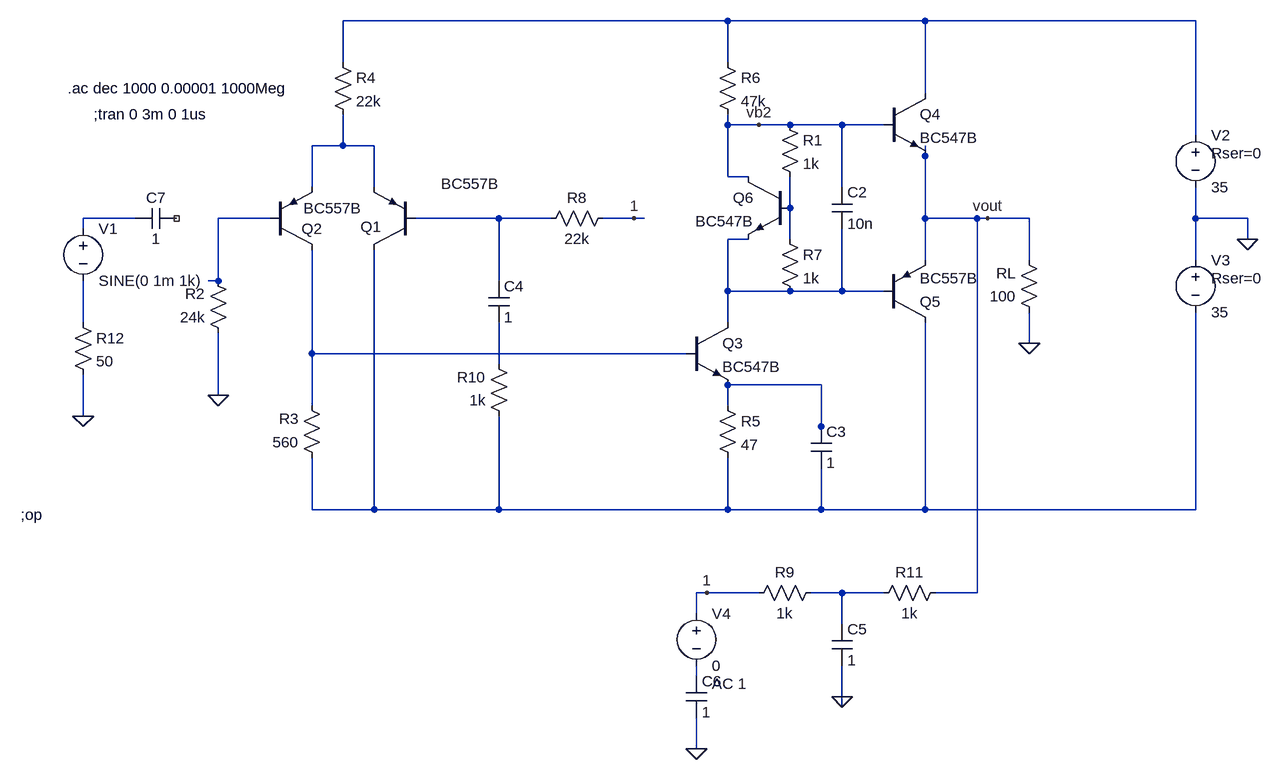
[diagram p0: schematic amplificador clase B.asc]
amplificador clase B.asc, the LTspice schematic file:
Version 4
SHEET 1 1220 680
WIRE -288 -512 -880 -512
WIRE 16 -512 -288 -512
WIRE 432 -512 16 -512
WIRE -880 -448 -880 -512
WIRE -288 -448 -288 -512
WIRE 16 -400 16 -512
WIRE -288 -352 -288 -368
WIRE -240 -352 -288 -352
WIRE -192 -352 -240 -352
WIRE -112 -352 -192 -352
WIRE -48 -352 -112 -352
WIRE 432 -336 432 -512
WIRE -880 -320 -880 -368
WIRE -880 -320 -928 -320
WIRE -832 -320 -880 -320
WIRE 16 -304 16 -320
WIRE -288 -272 -288 -352
WIRE -256 -272 -288 -272
WIRE -928 -256 -928 -320
WIRE -832 -256 -832 -320
WIRE -112 -256 -112 -352
WIRE -192 -224 -192 -272
WIRE -1200 -208 -1280 -208
WIRE -992 -208 -1072 -208
WIRE -640 -208 -768 -208
WIRE -560 -208 -640 -208
WIRE -432 -208 -480 -208
WIRE -416 -208 -432 -208
WIRE 16 -208 16 -304
WIRE 96 -208 16 -208
WIRE 112 -208 96 -208
WIRE 176 -208 112 -208
WIRE 432 -208 432 -256
WIRE 512 -208 432 -208
WIRE -1280 -192 -1280 -208
WIRE -256 -176 -288 -176
WIRE -192 -176 -192 -224
WIRE 512 -176 512 -208
WIRE 16 -144 16 -208
WIRE 176 -144 176 -208
WIRE 432 -144 432 -208
WIRE -1072 -112 -1072 -208
WIRE -1072 -112 -1088 -112
WIRE -640 -112 -640 -208
WIRE -288 -96 -288 -176
WIRE -192 -96 -288 -96
WIRE -112 -96 -112 -192
WIRE -112 -96 -192 -96
WIRE -48 -96 -112 -96
WIRE -1280 -48 -1280 -112
WIRE -288 -48 -288 -96
WIRE 176 -16 176 -64
WIRE -928 0 -928 -160
WIRE -352 0 -928 0
WIRE -640 16 -640 -48
WIRE -144 48 -288 48
WIRE -1072 64 -1072 -32
WIRE -928 80 -928 0
WIRE -288 80 -288 48
WIRE -1280 96 -1280 32
WIRE -144 112 -144 48
WIRE -144 128 -144 112
WIRE -928 240 -928 160
WIRE -832 240 -832 -160
WIRE -832 240 -928 240
WIRE -640 240 -640 96
WIRE -640 240 -832 240
WIRE -288 240 -288 160
WIRE -288 240 -640 240
WIRE -144 240 -144 176
WIRE -144 240 -288 240
WIRE 16 240 16 -48
WIRE 16 240 -144 240
WIRE 432 240 432 -64
WIRE 432 240 16 240
WIRE -320 368 -336 368
WIRE -240 368 -320 368
WIRE -112 368 -160 368
WIRE -48 368 -112 368
WIRE 96 368 96 -208
WIRE 96 368 32 368
WIRE -336 400 -336 368
WIRE -112 416 -112 368
WIRE -336 496 -336 480
WIRE -112 528 -112 480
WIRE -112 544 -112 528
WIRE -336 608 -336 560
FLAG 512 -176 0
FLAG -1072 64 0
FLAG 176 -16 0
FLAG 112 -208 vout
FLAG -240 -352 vb2
FLAG -112 528 0
FLAG -336 608 0
FLAG -432 -208 1
FLAG -1280 96 0
FLAG -320 368 1
SYMBOL res -896 -464 R0
SYMATTR InstName R4
SYMATTR Value 22k
SYMBOL res -1056 -16 R180
WINDOW 0 36 76 Left 2
WINDOW 3 36 40 Left 2
SYMATTR InstName R2
SYMATTR Value 24k
SYMBOL res -912 176 R180
WINDOW 0 36 76 Left 2
WINDOW 3 36 40 Left 2
SYMATTR InstName R3
SYMATTR Value 560
SYMBOL res -304 64 R0
SYMATTR InstName R5
SYMATTR Value 47
SYMBOL res -304 -464 R0
SYMATTR InstName R6
SYMATTR Value 47k
SYMBOL res -464 -224 R90
WINDOW 0 0 56 VBottom 2
WINDOW 3 32 56 VTop 2
SYMATTR InstName R8
SYMATTR Value 22k
SYMBOL res -624 112 R180
WINDOW 0 36 76 Left 2
WINDOW 3 36 40 Left 2
SYMATTR InstName R10
SYMATTR Value 1k
SYMBOL res 192 -48 R180
WINDOW 0 36 76 Left 2
WINDOW 3 36 40 Left 2
SYMATTR InstName RL
SYMATTR Value 100
SYMBOL voltage 432 -352 R0
WINDOW 123 0 0 Left 2
WINDOW 39 24 44 Left 2
SYMATTR SpiceLine Rser=0
SYMATTR InstName V2
SYMATTR Value 35
SYMBOL voltage 432 -160 R0
WINDOW 123 0 0 Left 2
WINDOW 39 24 44 Left 2
SYMATTR SpiceLine Rser=0
SYMATTR InstName V3
SYMATTR Value 35
SYMBOL pnp -768 -160 R180
WINDOW 0 53 35 Left 2
WINDOW 3 -128 101 Left 2
SYMATTR InstName Q1
SYMATTR Value BC557B
SYMBOL pnp -992 -160 M180
WINDOW 0 48 32 Left 2
WINDOW 3 51 64 Left 2
SYMATTR InstName Q2
SYMATTR Value BC557B
SYMBOL npn -352 -48 R0
SYMATTR InstName Q3
SYMATTR Value BC547B
SYMBOL npn -48 -400 R0
SYMATTR InstName Q4
SYMATTR Value BC547B
SYMBOL cap -656 -112 R0
SYMATTR InstName C4
SYMATTR Value 1
SYMBOL cap -160 112 R0
SYMATTR InstName C3
SYMATTR Value 1
SYMBOL pnp -48 -48 M180
SYMATTR InstName Q5
SYMATTR Value BC557B
SYMBOL npn -192 -272 M0
SYMATTR InstName Q6
SYMATTR Value BC547B
SYMBOL res -208 -368 R0
SYMATTR InstName R1
SYMATTR Value 1k
SYMBOL res -208 -192 R0
SYMATTR InstName R7
SYMATTR Value 1k
SYMBOL cap -128 -256 R0
SYMATTR InstName C2
SYMATTR Value 10n
SYMBOL res -144 352 R90
WINDOW 0 0 56 VBottom 2
WINDOW 3 32 56 VTop 2
SYMATTR InstName R9
SYMATTR Value 1k
SYMBOL res 48 352 R90
WINDOW 0 0 56 VBottom 2
WINDOW 3 32 56 VTop 2
SYMATTR InstName R11
SYMATTR Value 1k
SYMBOL cap -128 416 R0
SYMATTR InstName C5
SYMATTR Value 1
SYMBOL cap -352 496 R0
SYMATTR InstName C6
SYMATTR Value 1
SYMBOL voltage -336 384 R0
WINDOW 123 24 124 Left 2
WINDOW 39 0 0 Left 2
SYMATTR Value2 AC 1
SYMATTR InstName V4
SYMATTR Value 0
SYMBOL voltage -1280 -208 R0
WINDOW 123 24 44 Left 2
WINDOW 39 0 0 Left 2
SYMATTR InstName V1
SYMATTR Value SINE(0 1m 1k)
SYMBOL res -1296 -64 R0
SYMATTR InstName R12
SYMATTR Value 50
SYMBOL cap -1136 -224 R90
WINDOW 0 0 32 VBottom 2
WINDOW 3 32 32 VTop 2
SYMATTR InstName C7
SYMATTR Value 1
TEXT -1376 248 Left 2 !;op
TEXT -1264 -368 Left 2 !;tran 0 3m 0 1us
TEXT -1304 -408 Left 2 !.ac dec 1000 0.00001 1000Meg

The netlist it stands for:
* amplificador clase B.asc
R4 N001 N002 22k
R2 0 N005 24k
R3 N012 N009 560
R5 N011 N012 47
R6 N001 vb2 47k
R8 1 N006 22k
R10 N012 N010 1k
RL 0 vout 100
V2 N001 0 35 Rser=0
V3 0 N012 35 Rser=0
Q1 N012 N006 N002 0 BC557B
Q2 N009 N005 N002 0 BC557B
Q3 N007 N009 N011 0 BC547B
Q4 N001 vb2 vout 0 BC547B
C4 N006 N010 1
C3 N011 N012 1
Q5 N012 N007 vout 0 BC557B
Q6 vb2 N003 N007 0 BC547B
R1 vb2 N003 1k
R7 N003 N007 1k
C2 vb2 N007 10n
R9 N013 1 1k
R11 vout N013 1k
C5 N013 0 1
C6 N014 0 1
V4 1 N014 0 AC 1
V1 N004 N008 SINE(0 1m 1k)
R12 N008 0 50
C7 NC_01 N004 1
.model NPN NPN
.model PNP PNP
.lib standard.bjt
;op
;tran 0 3m 0 1us
.ac dec 1000 0.00001 1000Meg
.backanno
.end